# Altium schematic sheet Connector.SchDoc
size A4; SheetNumber: 4; SheetTotal: 4
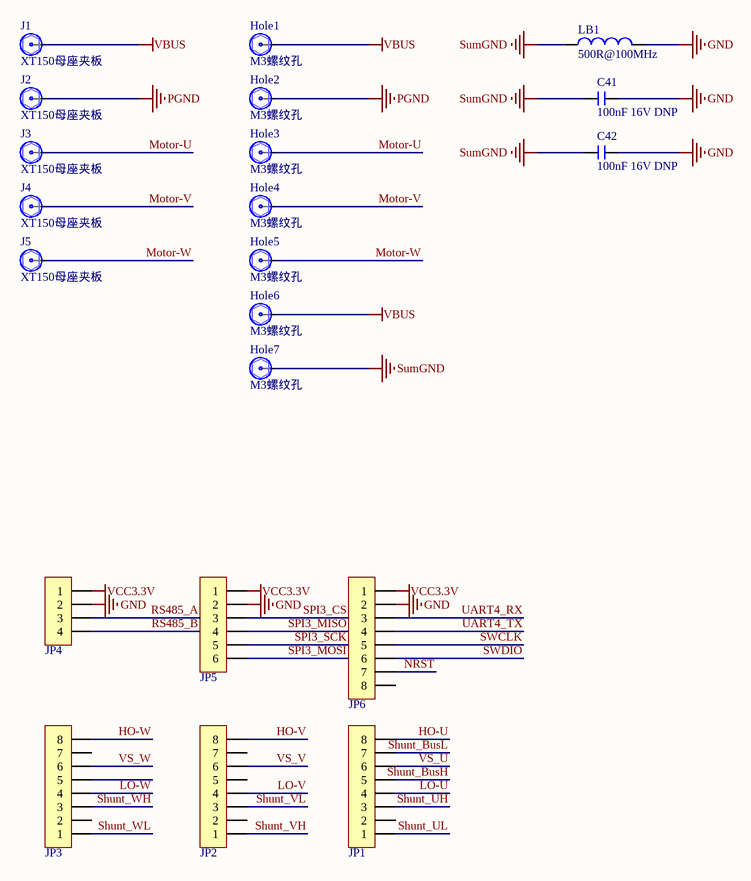
[diagram p0: Connector.SchDoc]

## Parts
C41  100nF 16V DNP  [C0603_L]
C42  100nF 16V DNP  [C0603_L]
Hole1  M3螺纹孔  [M3_3*7载流孔_铜柱]
Hole2  M3螺纹孔  [M3_3*7载流孔_铜柱]
Hole3  M3螺纹孔  [M3_3*7载流孔_螺丝]
Hole4  M3螺纹孔  [M3_3*7载流孔_螺丝]
Hole5  M3螺纹孔  [M3_3*7载流孔_螺丝]
Hole6  M3螺纹孔  [M3_3*7载流孔_铜柱]
Hole7  M3螺纹孔  [M3_3*7载流孔_铜柱]
J1  XT150母座夹板  [XT150_母座夹板 - VBUS]
J2  XT150母座夹板  [XT150_母座夹板 - PGND]
J3  XT150母座夹板  [XT150_母座夹板 - duplicate]
J4  XT150母座夹板  [XT150_母座夹板]
J5  XT150母座夹板  [XT150_母座夹板]
JP1  HDR-1X8  [贴片排母2.54mm_交错_8P]  (value not drawn)
JP2  HDR-1X8  [贴片排母2.54mm_交错_8P]  (value not drawn)
JP3  HDR-1X8  [贴片排母2.54mm_交错_8P]  (value not drawn)
JP4  HDR-1X4  [MX 1.25-WS-4P]  (value not drawn)
JP5  HDR-1X6  [MX 1.25-WS-6P]  (value not drawn)
JP6  HDR-1X8  [MX 1.25-WS-8P]  (value not drawn)
LB1  500R@100MHz  [FB 0805_L]

## Nets
GND: C41.1 C42.1 JP4.2 JP5.2 JP6.2 LB1.2
PGND: Hole2.1 J2.1
SumGND: C41.2 C42.2 Hole7.1 LB1.1
VBUS: Hole1.1 Hole6.1 J1.1
VCC3.3V: JP4.1 JP5.1 JP6.1
HO-U: JP1.8
HO-V: JP2.8
HO-W: JP3.8
LO-U: JP1.4
LO-V: JP2.4
LO-W: JP3.4
Motor-U: Hole3.1 J3.1
Motor-V: Hole4.1 J4.1
Motor-W: Hole5.1 J5.1
NRST: JP6.7
RS485_A: JP4.3
RS485_B: JP4.4
Shunt_BusH: JP1.5
Shunt_BusL: JP1.7
Shunt_UH: JP1.3
Shunt_UL: JP1.1
Shunt_VH: JP2.1
Shunt_VL: JP2.3
Shunt_WH: JP3.3
Shunt_WL: JP3.1
SPI3_CS: JP5.3
SPI3_MISO: JP5.4
SPI3_MOSI: JP5.6
SPI3_SCK: JP5.5
SWCLK: JP6.5
SWDIO: JP6.6
UART4_RX: JP6.3
UART4_TX: JP6.4
VS_U: JP1.6
VS_V: JP2.6
VS_W: JP3.6

Not connected (* = marked no-connect by the designer): JP1 2; JP2 2 5 7; JP3 2 5 7; JP6 8

## Library data of the parts
C41 C42 = C-MLCC: 独石电容; 版权归属: 源创客; BOM名称: 独石电容; 学习资源: www.ooocke.com
JP1-JP3 JP6 = Header 8: 8P接插件; 版权归属: 源创客; BOM名称: 8P接插件; 学习资源: www.ooocke.com
JP4 = Header 4: 4P接插件; 版权归属: 源创客; BOM名称: 4P接插件; 学习资源: www.ooocke.com
JP5 = Header 6: 6P接插件; 版权归属: 源创客; BOM名称: 6P接插件; 学习资源: www.ooocke.com
LB1 = LB: 磁珠; 版权归属: 源创客; BOM名称: 磁珠; 学习资源: www.ooocke.com